# EAGLE schematic YUSynth-LFO-mainboard (EAGLE 9.6.2)
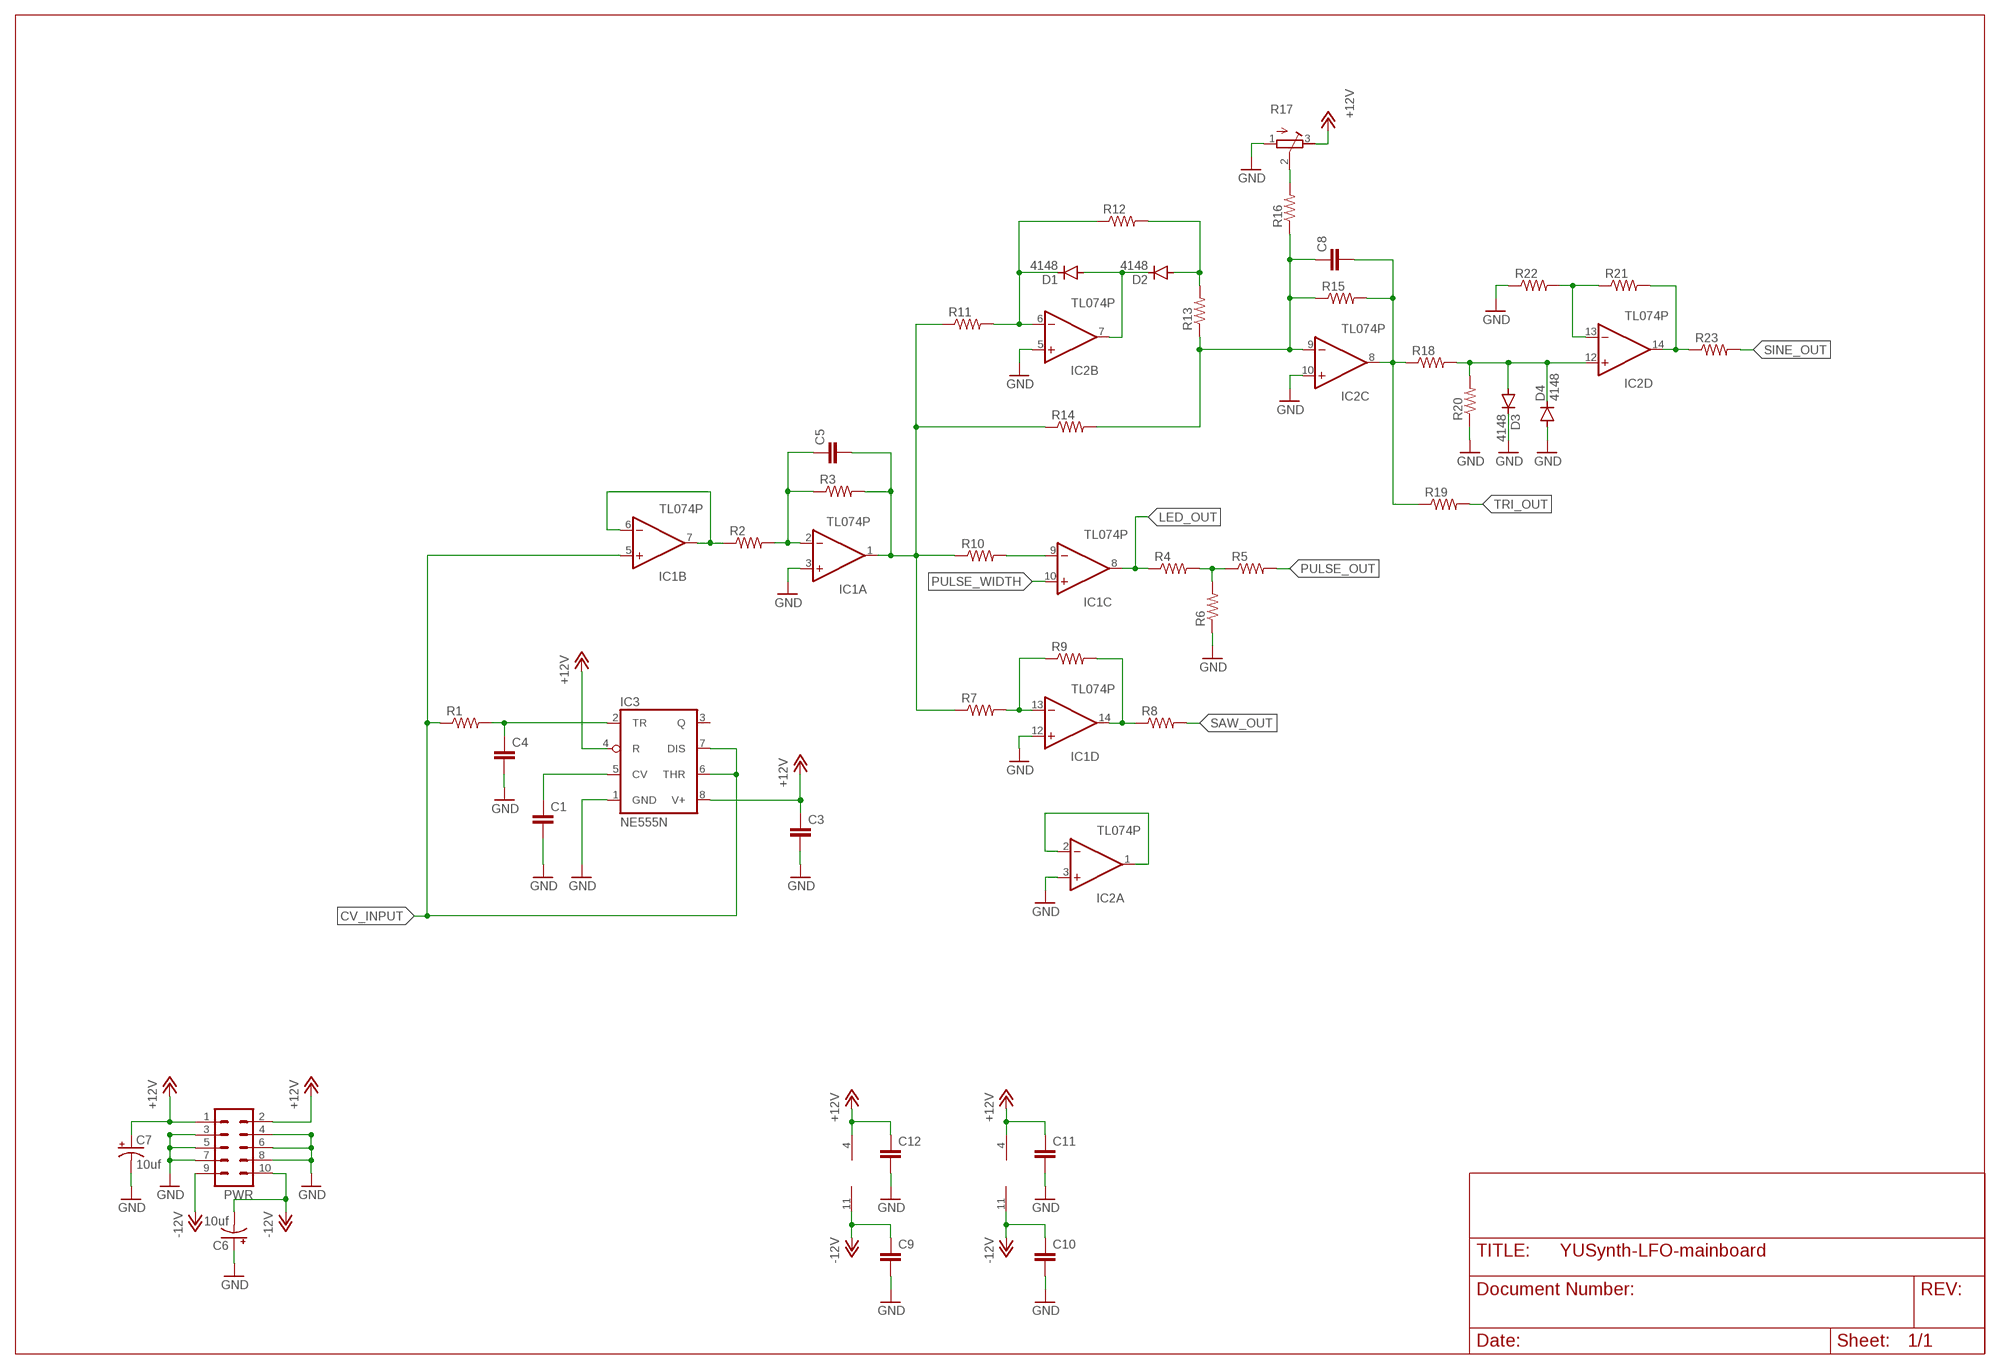
[diagram p0: schematic, sheet 1]

## Parts
C1  C-EU050-024X044  [C050-024X044]
C3  C-EU050-024X044  [C050-024X044]
C4  C-EU050-024X044  [C050-024X044]
C5  C-EU050-024X044  [C050-024X044]
C6  10uf  CPOL-USE2.5-5  [E2,5-5]
C7  10uf  CPOL-USE2.5-5  [E2,5-5]
C8  C-EU050-024X044  [C050-024X044]
C9  C-EU050-024X044  [C050-024X044]
C10  C-EU050-024X044  [C050-024X044]
C11  C-EU050-024X044  [C050-024X044]
C12  C-EU050-024X044  [C050-024X044]
D1  4148  1N4148DO35-7  [DO35-7]
D2  4148  1N4148DO35-7  [DO35-7]
D3  4148  1N4148DO35-7  [DO35-7]
D4  4148  1N4148DO35-7  [DO35-7]
IC1  TL074P  [DIL14]
IC2  TL074P  [DIL14]
IC3  NE555N  [DIL08]
PWR  ML10  [ML10]
R1  R-US_0207/7  [0207/7]
R2  R-US_0207/7  [0207/7]
R3  R-US_0207/7  [0207/7]
R4  R-US_0207/7  [0207/7]
R5  R-US_0207/7  [0207/7]
R6  R-US_0207/7  [0207/7]
R7  R-US_0207/7  [0207/7]
R8  R-US_0207/7  [0207/7]
R9  R-US_0207/7  [0207/7]
R10  R-US_0207/7  [0207/7]
R11  R-US_0207/7  [0207/7]
R12  R-US_0207/7  [0207/7]
R13  R-US_0207/7  [0207/7]
R14  R-US_0207/7  [0207/7]
R15  R-US_0207/7  [0207/7]
R16  R-US_0207/7  [0207/7]
R17  R-TRIMM64W  [RTRIM64W]
R18  R-US_0207/7  [0207/7]
R19  R-US_0207/7  [0207/7]
R20  R-US_0207/7  [0207/7]
R21  R-US_0207/7  [0207/7]
R22  R-US_0207/7  [0207/7]
R23  R-US_0207/7  [0207/7]

## Nets
+12V: C3.1 C7.+ C11.1 C12.1 IC1.4(P:V+) IC2.4(P:V+) IC3.4(R) IC3.8(V+) PWR.1 PWR.2 R17.3(E)
-12V: C6.- C9.1 C10.1 IC1.11(P:V-) IC2.11(P:V-) PWR.9 PWR.10
CV_INPUT: IC1.5(B:+IN) IC3.6(THR) IC3.7(DIS) R1.1
GND: C1.2 C3.2 C4.2 C6.+ C7.- C9.2 C10.2 C11.2 C12.2 D3.C D4.A IC1.3(A:+IN) IC1.12(D:+IN) IC2.3(A:+IN) IC2.5(B:+IN) IC2.10(C:+IN) IC3.1(GND) PWR.3 PWR.4 PWR.5 PWR.6 PWR.7 PWR.8 R6.1 R17.1(A) R20.1 R22.1
LED_OUT: IC1.8(C:OUT) R4.1
N$1: C1.1 IC3.5(CV)
N$2: C4.1 IC3.2(TR) R1.2
N$3: IC1.6(B:-IN) IC1.7(B:OUT) R2.1
N$4: C5.1 IC1.2(A:-IN) R2.2 R3.1
N$6: R4.2 R5.1 R6.2
N$7: IC1.14(D:OUT) R8.1 R9.2
N$8: C5.2 IC1.1(A:OUT) R3.2 R7.1 R10.1 R11.1 R14.1
N$9: IC1.13(D:-IN) R7.2 R9.1
N$10: IC2.1(A:OUT) IC2.2(A:-IN)
N$11: IC1.9(C:-IN) R10.2
N$12: D1.C IC2.6(B:-IN) R11.2 R12.1
N$13: C8.1 IC2.9(C:-IN) R13.1 R14.2 R15.1 R16.1
N$14: D1.A D2.C IC2.7(B:OUT)
N$15: D2.A R12.2 R13.2
N$16: R16.2 R17.2(S)
N$17: C8.2 IC2.8(C:OUT) R15.2 R18.1 R19.1
N$18: D3.A D4.C IC2.12(D:+IN) R18.2 R20.2
N$19: IC2.14(D:OUT) R21.2 R23.1
N$20: IC2.13(D:-IN) R21.1 R22.2
PULSE_OUT: R5.2
PULSE_WIDTH: IC1.10(C:+IN)
SAW_OUT: R8.2
SINE_OUT: R23.2
TRI_OUT: R19.2
Unconnected: IC3.3(Q)

## Library data of the parts
C1 C3-C5 C8-C12 = rcl:C-EU: CAPACITOR, European symbol; SPICEPREFIX: C
C6 C7 = resistor:CPOL-US: POLARIZED CAPACITOR, American symbol
D1-D4 = diode:1N4148: DIODE high speed (Philips)
IC1 IC2 = linear:TL074: OP AMP
IC3 = linear:*555: TIMER
PWR = con-ml:ML10: HARTING; OC_FARNELL: unknown; OC_NEWARK: unknown
R1-R16 R18-R23 = rcl:R-US_: RESISTOR, American symbol; SPICEPREFIX: R
R17 = rcl:R-TRIMM: Trimm resistor; SPICEMODEL: X; SPICEPREFIXL: POT